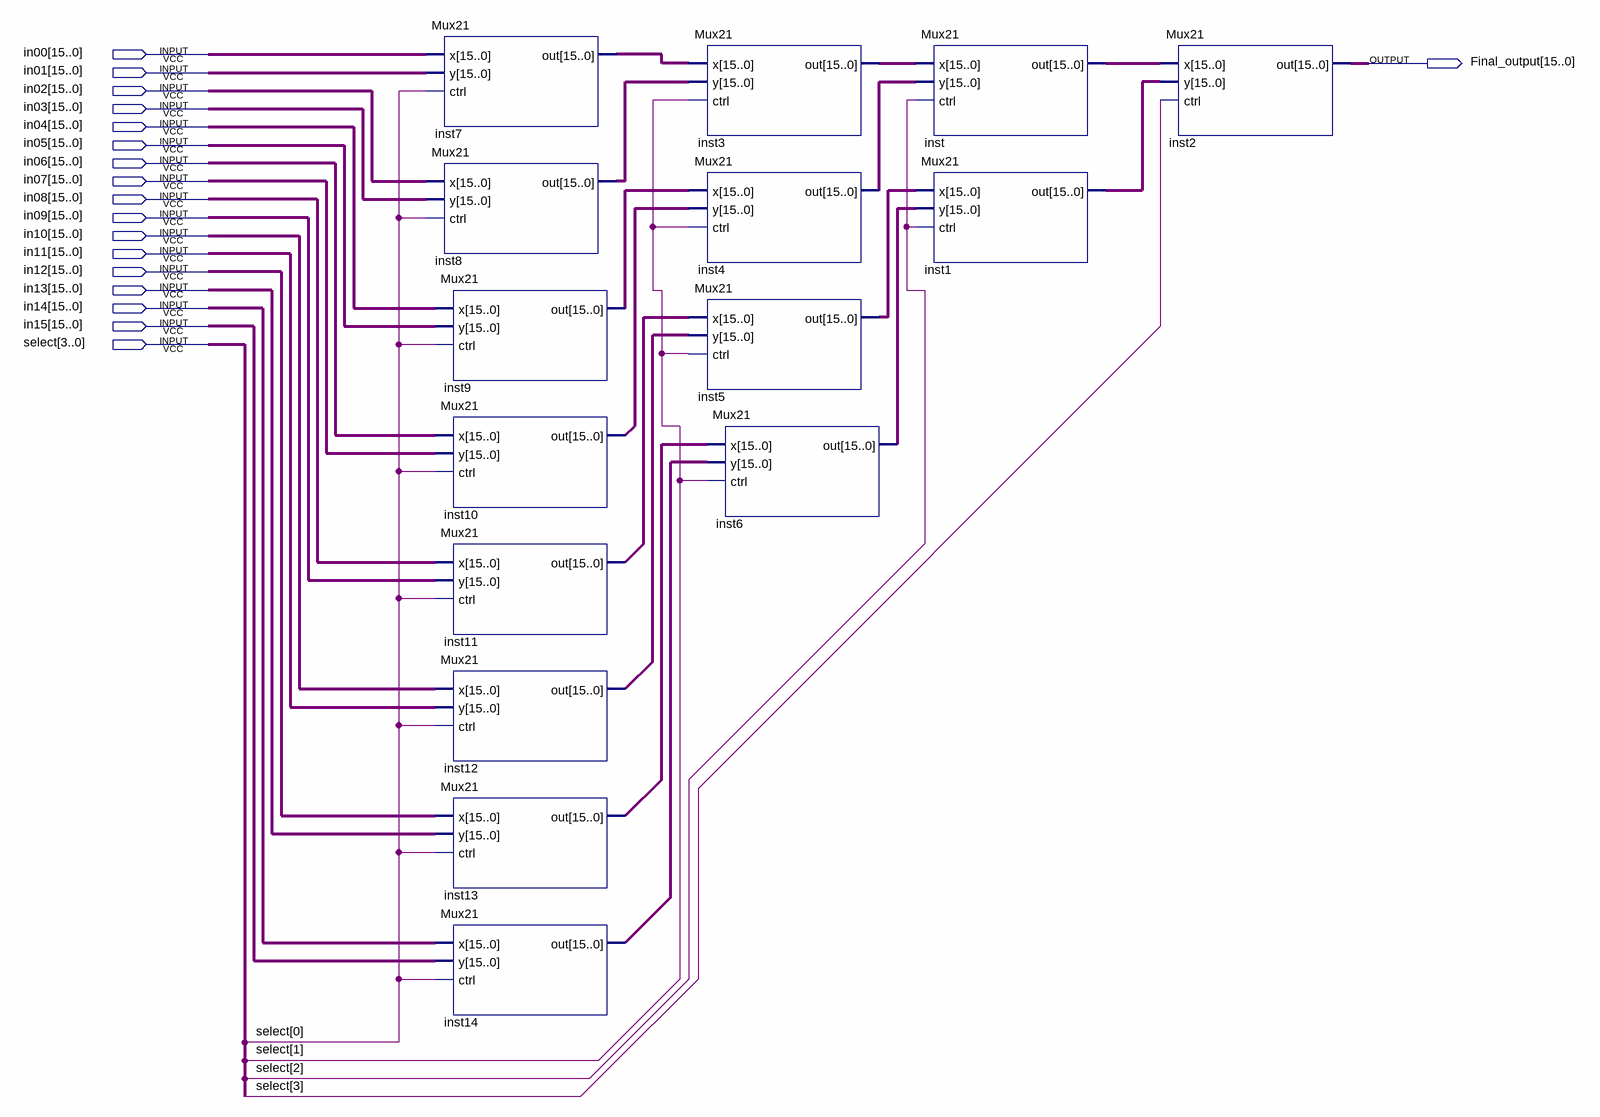
[diagram p0: schematic sheet]
// Quartus schematic mux16_1.bdf as structural Verilog: 15 symbols, 18 pins
module mux16_1 (
  input  [15:0] in00,
  input  [15:0] in01,
  input  [15:0] in02,
  input  [15:0] in03,
  input  [15:0] in04,
  input  [15:0] in05,
  input  [15:0] in06,
  input  [15:0] in07,
  input  [15:0] in08,
  input  [15:0] in09,
  input  [15:0] in10,
  input  [15:0] in11,
  input  [15:0] in12,
  input  [15:0] in13,
  input  [15:0] in14,
  input  [15:0] in15,
  input  [3:0] select,
  output [15:0] Final_output
);

  wire [15:0] inst1_out, inst3_out, inst4_out, inst5_out, inst6_out, inst7_out, inst8_out, inst9_out,
       inst10_out, inst11_out, inst12_out, inst13_out, inst14_out, inst_out;

  Mux21 inst7 (.x(in00), .y(in01), .ctrl(select[0]), .out(inst7_out));
  Mux21 inst8 (.x(in02), .y(in03), .ctrl(select[0]), .out(inst8_out));
  Mux21 inst9 (.x(in04), .y(in05), .ctrl(select[0]), .out(inst9_out));
  Mux21 inst10 (.x(in06), .y(in07), .ctrl(select[0]), .out(inst10_out));
  Mux21 inst11 (.x(in08), .y(in09), .ctrl(select[0]), .out(inst11_out));
  Mux21 inst12 (.x(in10), .y(in11), .ctrl(select[0]), .out(inst12_out));
  Mux21 inst13 (.x(in12), .y(in13), .ctrl(select[0]), .out(inst13_out));
  Mux21 inst14 (.x(in14), .y(in15), .ctrl(select[0]), .out(inst14_out));
  Mux21 inst3 (.x(inst7_out), .y(inst8_out), .ctrl(select[1]), .out(inst3_out));
  Mux21 inst4 (.x(inst9_out), .y(inst10_out), .ctrl(select[1]), .out(inst4_out));
  Mux21 inst5 (.x(inst11_out), .y(inst12_out), .ctrl(select[1]), .out(inst5_out));
  Mux21 inst6 (.x(inst13_out), .y(inst14_out), .ctrl(select[1]), .out(inst6_out));
  Mux21 inst (.x(inst3_out), .y(inst4_out), .ctrl(select[2]), .out(inst_out));
  Mux21 inst1 (.x(inst5_out), .y(inst6_out), .ctrl(select[2]), .out(inst1_out));
  Mux21 inst2 (.x(inst_out), .y(inst1_out), .ctrl(select[3]), .out(Final_output));
endmodule
